# EAGLE design ESP SmartWatch (EAGLE 9.0.1)
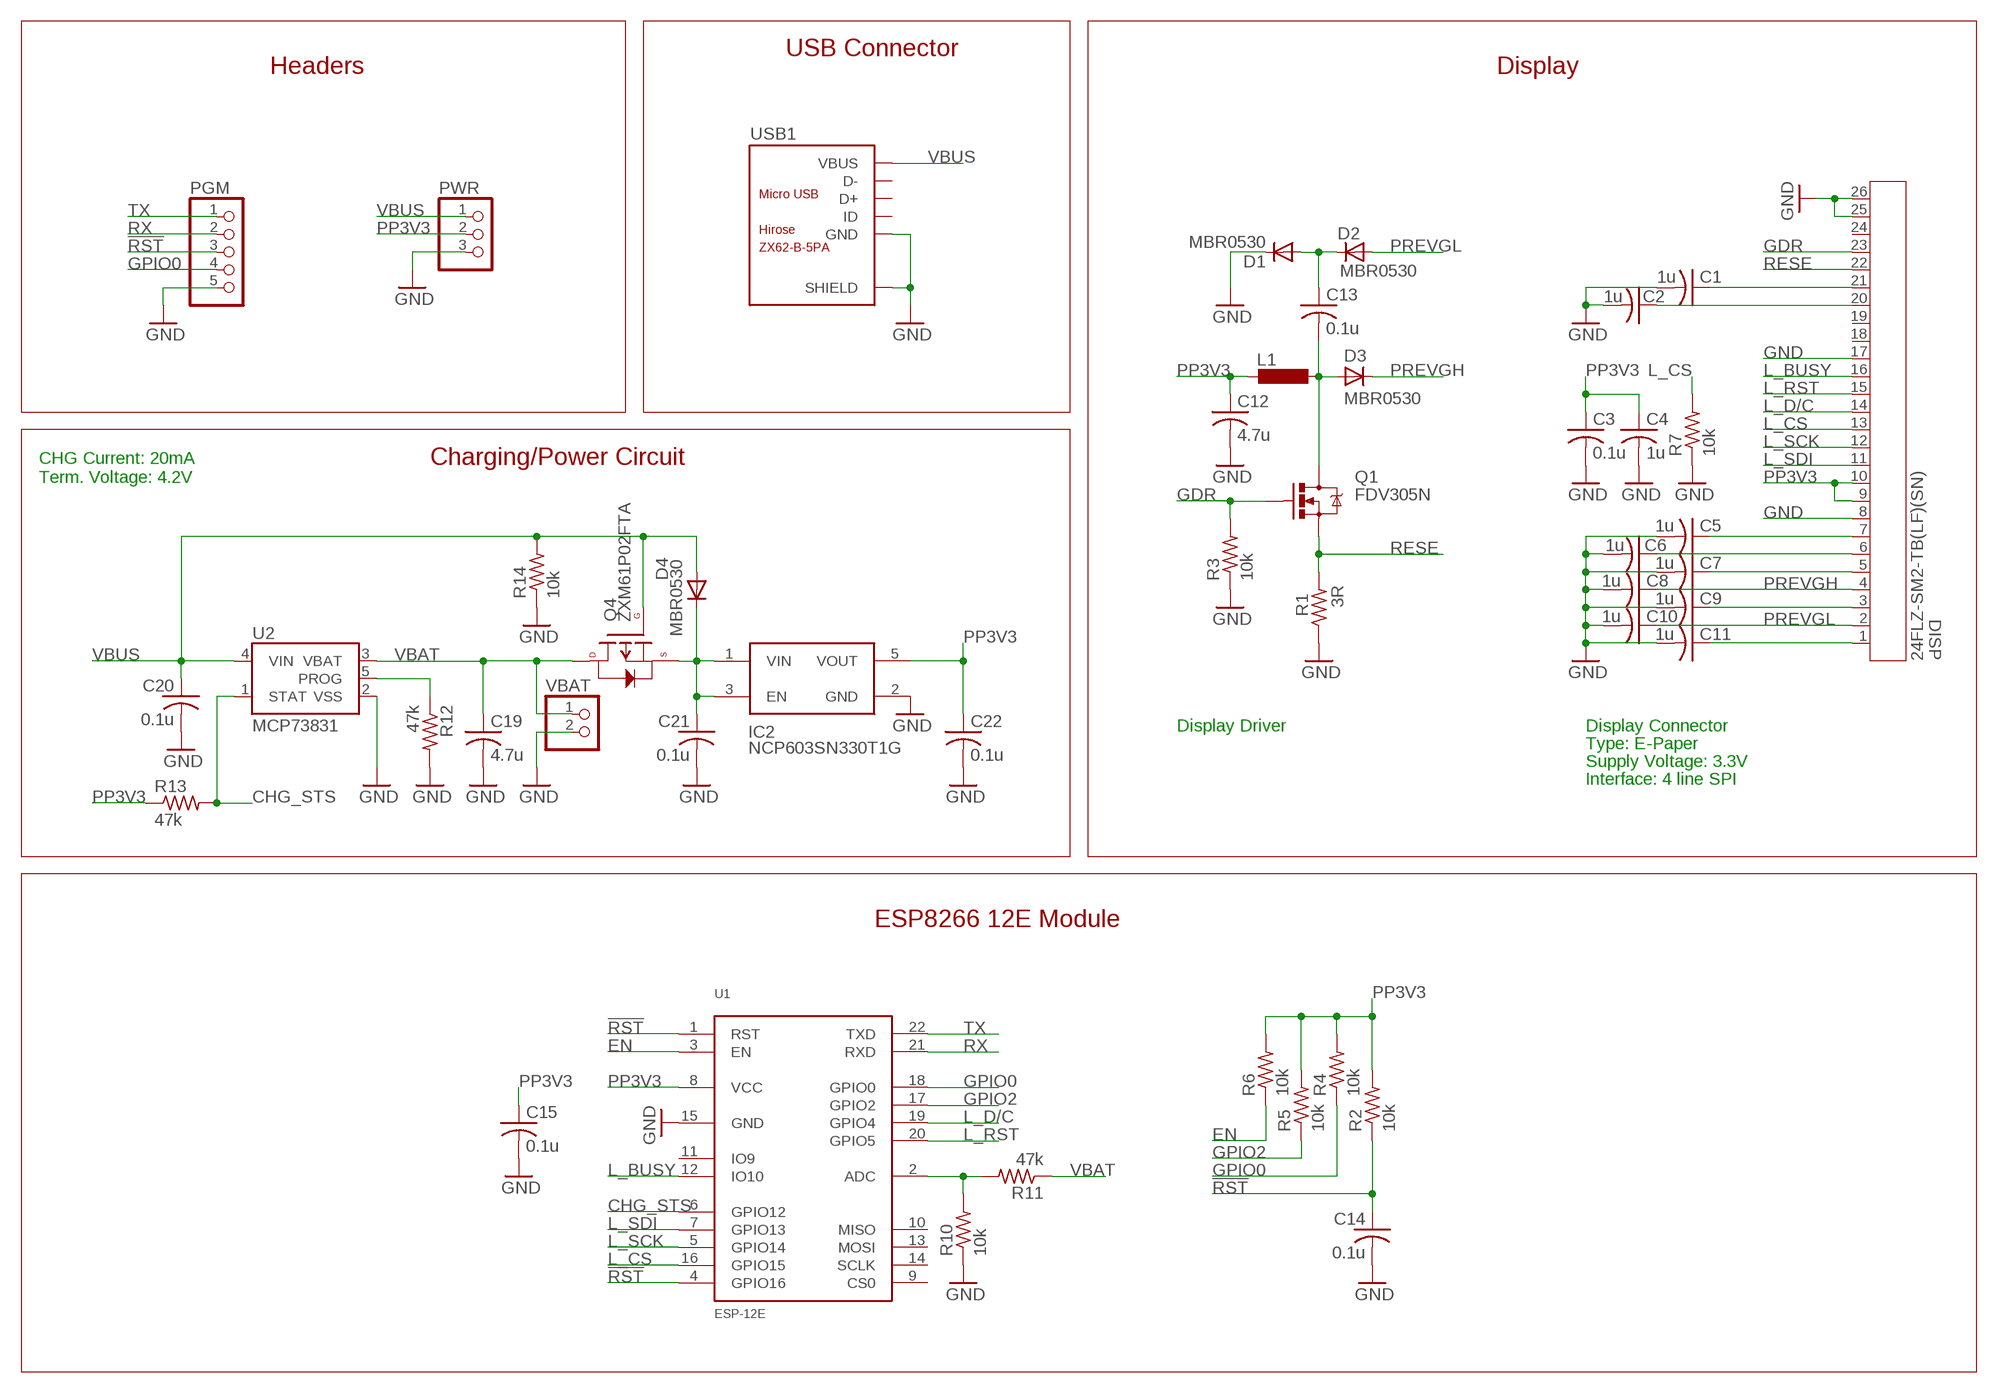
[diagram p0: schematic, sheet 1]

## Parts
C1  1u  C-USC0603  [C0603]
C2  1u  C-USC0603  [C0603]
C3  0.1u  C-USC0603  [C0603]
C4  1u  C-USC0603  [C0603]
C5  1u  C-USC0603  [C0603]
C6  1u  C-USC0603  [C0603]
C7  1u  C-USC0603  [C0603]
C8  1u  C-USC0603  [C0603]
C9  1u  C-USC0603  [C0603]
C10  1u  C-USC0603  [C0603]
C11  1u  C-USC0603  [C0603]
C12  4.7u  C-USC0603  [C0603]
C13  0.1u  C-USC0603  [C0603]
C14  0.1u  C-USC0603  [C0603]
C15  0.1u  C-USC0603  [C0603]
C19  4.7u  C-USC0603  [C0603]
C20  0.1u  C-USC0603  [C0603]
C21  0.1u  C-USC0603  [C0603]
C22  0.1u  C-USC0603  [C0603]
D1  MBR0530  MBR0520LT  [SOD123]
D2  MBR0530  MBR0520LT  [SOD123]
D3  MBR0530  MBR0520LT  [SOD123]
D4  MBR0530  MBR0520LT  [SOD123]
DISP  24FLZ-SM2-TB(LF)(SN)  [CON24_1X24_DB_JST]
IC2  NCP603SN330T1G  [SOT95P275X110-5N]
L1  ASPI-6045S-680M-T  [ASPI-6045S-680M-T]
PGM  PINHD-1X05_2.00  [1X05M]
PWR  PINHD-1X03_2.00  [1X03M]
Q1  FDV305N  MOSFET-NCHANNELAO3404A  [SOT23-3]
Q4  ZXM61P02FTA  P-CHANNEL-MOSFET  [SOT23-3]
R1  3R  R-US_R0603  [R0603]
R2  10k  R-US_R0603  [R0603]
R3  10k  R-US_R0603  [R0603]
R4  10k  R-US_R0603  [R0603]
R5  10k  R-US_R0603  [R0603]
R6  10k  R-US_R0603  [R0603]
R7  10k  R-US_R0603  [R0603]
R10  10k  R-US_R0603  [R0603]
R11  47k  R-US_R0603  [R0603]
R12  47k  R-US_R0603  [R0603]
R13  47k  R-US_R0603  [R0603]
R14  10k  R-US_R0603  [R0603]
U1  ESP-12E  ESP-12F  [ESP-12F]
U2  MCP73831  [SOT23-5]
USB1  ZX62-B-5PA  MICRO-USB-SMD(ZX62-B-5PA)  [MICRO-USB5+6P-SMD-0.65-AB]
VBAT  PINHD-1X02_2.00  [1X02M]

## Nets
!RST: C14.1 PGM.3 R2.1 U1.1(RST) U1.4(GPIO16)
CHG_STS: R13.2 U1.6(GPIO12) U2.1(STAT)
EN: R6.1 U1.3(EN)
GDR: DISP.23 Q1.1(G) R3.2
GND: C1.2 C2.2 C3.2 C4.2 C5.2 C6.2 C7.2 C8.2 C9.2 C10.2 C11.2 C12.2 C14.2 C15.2 C19.2 C20.2 C21.2 C22.2 D1.C DISP.8 DISP.17 DISP.25 DISP.26 IC2.2(GND) PGM.5 PWR.3 R1.1 R3.1 R7.1 R10.1 R12.2 R14.1 U1.15(GND) U2.2(VSS) USB1.5(GND) USB1.P1(SHIELD) USB1.P2(SHIELD) USB1.P3_1(SHIELD) USB1.P3_2(SHIELD) USB1.P3_3(SHIELD) USB1.P4_1(SHIELD) USB1.P4_2(SHIELD) USB1.P4_3(SHIELD) USB1.P5(SHIELD) USB1.P6(SHIELD) VBAT.2
GPIO0: PGM.4 R4.1 U1.18(GPIO0)
GPIO2: R5.1 U1.17(GPIO2)
L_BUSY: DISP.16 U1.12(IO10)
L_CS: DISP.13 R7.2 U1.16(GPIO15)
L_D/C: DISP.14 U1.19(GPIO4)
L_RST: DISP.15 U1.20(GPIO5)
L_SCK: DISP.12 U1.5(GPIO14)
L_SDI: DISP.11 U1.7(GPIO13)
N$1: C1.1 DISP.21
N$2: C2.1 DISP.20
N$3: C13.1 D1.A D2.C
N$5: C13.2 D3.A L1.2 Q1.3(D)
N$8: R10.2 R11.2 U1.2(ADC)
N$10: R12.1 U2.5(PROG)
N$12: C21.1 D4.C IC2.1(VIN) IC2.3(EN) Q4.2(S)
N$15: C5.1 DISP.7
N$16: C6.1 DISP.6
N$17: C7.1 DISP.5
N$19: C9.1 DISP.3
N$21: C11.1 DISP.1
PP3V3: C3.1 C4.1 C12.1 C15.1 C22.1 DISP.9 DISP.10 IC2.5(VOUT) L1.1 PWR.2 R2.2 R4.2 R5.2 R6.2 R13.1 U1.8(VCC)
PREVGH: C8.1 D3.C DISP.4
PREVGL: C10.1 D2.A DISP.2
RESE: DISP.22 Q1.2(S) R1.2
RX: PGM.2 U1.21(RXD)
TX: PGM.1 U1.22(TXD)
VBAT: C19.1 Q4.3(D) R11.1 U2.3(VBAT) VBAT.1
VBUS: C20.1 D4.A PWR.1 Q4.1(G) R14.2 U2.4(VIN) USB1.1(VBUS)
Unconnected: DISP.18 DISP.19 DISP.24 U1.9(CS0) U1.10(MISO) U1.11(IO9) U1.13(MOSI) U1.14(SCLK) USB1.2(D-) USB1.3(D+) USB1.4(ID)

## Notes on the sheet
- USB Connector
- Headers | Display
- Charging/Power Circuit
- CHG Current: 20mA
  Term. Voltage: 4.2V
- Display Driver | Display Connector
- Type: E-Paper
- Supply Voltage: 3.3V
- Interface: 4 line SPI
- ESP8266 12E Module

## Library data of the parts
C1-C15 C19-C22 = A1 VoLTE IoT Design:C-US: CAPACITOR, American symbol
D1-D4 = diode:MBR0520LT: SCHOTTKY BARRIER RECTIFIER Source: http://onsemi.com .. MBR0520LT1-D.pdf
DISP = 24FLZ-SM2-TB:24FLZ-SM2-TB(LF)(SN); MANUFACTURER_PART_NUMBER: 24FLZSM2TBLFSN; VENDOR: JST
IC2 = DusteeBoard:NCP603SN330T1G: Source: Datasheet <http://www.onsemi.com/pub/Collateral/NCP603-D.PDF>; ALLIED_NUMBER: 70467130; ALLIED_PRICE-STOCK: http://www.alliedelec.com/on-semiconductor-ncp603sn330t1g/70467130/; ARROW_PART_NUMBER: NCP603SN330T1G; ARROW_PRICE-STOCK: https://www.arrow.com/en/products/ncp603sn330t1g/on-semiconductor; HEIGHT: 1.1mm; MANUFACTURER_NAME: ON Semiconductor; MANUFACTURER_PART_NUMBER: NCP603SN330T1G; RS_PART_NUMBER: 8051845P; RS_PRICE-STOCK: http://uk.rs-online.com/web/p/products/8051845P
L1 = Customs:ASPI-6045S-680M-T
PGM = pinhead-2:PINHD-1X05: PIN HEADER
PWR = pinhead-2:PINHD-1X03: PIN HEADER
Q1 = LORA Gateway wGSM:MOSFET-NCHANNEL: Common NMOSFET Parts MFG P/N Store ID Prod ID FDD8780 TRANS-09984 SI7820DN TRANS-11055 FDS6630A IC-08089 2N7002PW TRANS-11151 FQP30N06L COM-10213 TRANS-10060 BSS123LT1G TRANS-08345 BSS138 TRANS-00830 BS170 2N7000; PROD_ID: TRAN-12988
Q4 = A1 VoLTE IoT Design:P-CHANNEL-MOSFET: P-Channel MOSFET Mode Field Effect Transistor
R1-R7 R10-R14 = adafruit:R-US_: RESISTOR, American symbol
U1 = Seeed-OPL-2017-01-Sensor-camilo:ESP-12F: 317060163
U2 = DusteeBoard:MCP73831: Miniature single cell, fully integrated Li-Ion, Li-polymer charge management controller http://ww1.microchip.com/downloads/en/DeviceDoc/20001984g.pdf IC-09995; PROD_ID: IC-09995
USB1 = A1 VoLTE IoT Design:MICRO-USB-SMD(ZX62-B-5PA): 320010005; MPN: ZX62-B-5PA
VBAT = pinhead-2:PINHD-1X02: PIN HEADER

## Board
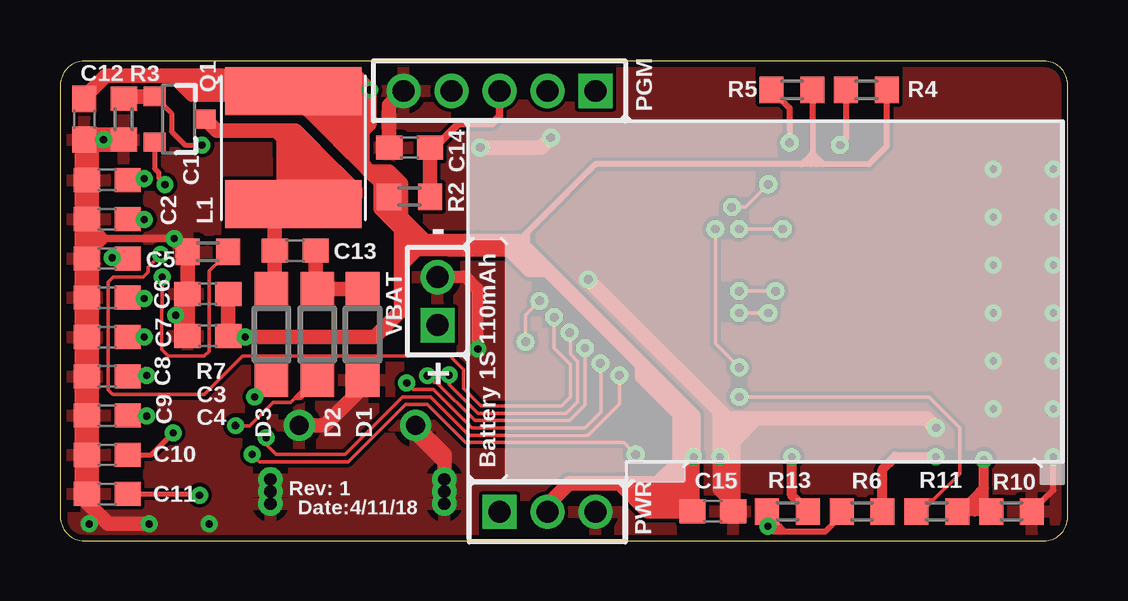
[diagram p1: board, top side]
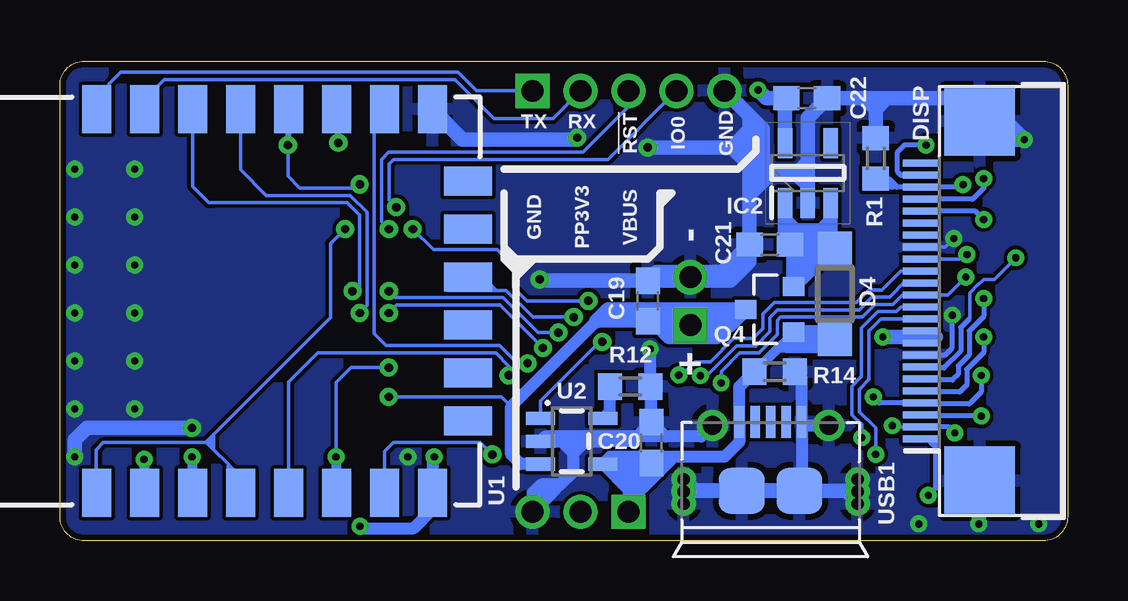
[diagram p2: board, bottom side, seen from below]

Size 42 x 20 mm. Coordinates in mm from the lower left corner, seen from the top.
Outline: 0,19 0,1 arc90 1,0 41,0 arc90 42,1 42,19 arc90 41,20 1,20 arc90 0,19
Copper layers (1*16): Top 0.035mm / dielectric 1.5mm / Bottom 0.035mm
Design rules "SeeedStudio_2layer_DRU_no_angle_20140221 *": minimum track width 6mil, minimum drill 0.3mm, track to track 6mil, track to pad 6mil, pad to pad 6mil, via to via 6mil, smd to smd 0mil, copper to edge 10mil, drill to drill 6mil, minimum pad ring 10mil, minimum via ring 8mil, stop-mask expansion 4mil, vias tented up to drill 0.75mm, thermal gap 10mil

### Footprints (pad centres in the part's own frame; a part is rotated, then mirrored left to right if it is on the bottom)
C0603 = smd 1.1 x 1: 1 -0.85,0; 2 0.85,0
SOD123 = smd 1.4 x 1.4: A 1.9,0; C -1.9,0
CON24_1X24_DB_JST = smd 0.3 x 1.524: 1 5.75,-2.698; 2 5.25,-2.698; 3 4.75,-2.698; 4 4.25,-2.698; 5 3.75,-2.698; 6 3.25,-2.698; 7 2.75,-2.698; 8 2.25,-2.698; 9 1.75,-2.698; 10 1.25,-2.698; 11 0.75,-2.698; 12 0.25,-2.698; 13 -0.25,-2.698; 14 -0.75,-2.698; 15 -1.25,-2.698; 16 -1.75,-2.698; 17 -2.25,-2.698; 18 -2.75,-2.698; 19 -3.25,-2.698; 20 -3.75,-2.698; 21 -4.25,-2.698; 22 -4.75,-2.698; 23 -5.25,-2.698; 24 -5.75,-2.698 | smd 2.845 x 2.946: 25 -7.493,-0.26; 26 7.493,-0.26
SOT95P275X110-5N = smd 1.25 x 0.6: 1 -1.25,0.95; 2 -1.25,0; 3 -1.25,-0.95; 4 1.25,-0.95; 5 1.25,0.95
ASPI-6045S-680M-T = smd 2 x 5.7: 1 -2.35,0; 2 2.35,0
1X05M = drill 0.914 square: 1 -4,0 | drill 0.914: 2 -2,0; 3 0,0; 4 2,0; 5 4,0
1X03M = drill 0.914 square: 1 -2,0 | drill 0.914: 2 0,0; 3 2,0
SOT23-3 = smd 0.8 x 0.9: 1 -0.95,-1; 2 0.95,-1; 3 0,1.1
SOT23-3' = smd 0.8 x 0.9: 1 -0.95,-1; 2 0.95,-1; 3 0,1
R0603 = smd 1 x 1.1: 1 -0.85,0; 2 0.85,0
ESP-12F = smd 2 x 1.2: 1 -8,3.48; 2 -8,1.48; 3 -8,-0.52; 4 -8,-2.52; 5 -8,-4.52; 6 -8,-6.52; 7 -8,-8.52; 8 -8,-10.52; 15 8,-10.52; 16 8,-8.52; 17 8,-6.52; 18 8,-4.52; 19 8,-2.52; 20 8,-0.52; 21 8,1.48; 22 8,3.48 | smd 1.2 x 2: 9 -5,-12; 10 -3,-12; 11 -1,-12; 12 1,-12; 13 3,-12; 14 5,-12
SOT23-5 = smd 0.55 x 1.2: 1 -0.95,-1.3; 2 0,-1.3; 3 0.95,-1.3; 4 0.95,1.3; 5 -0.95,1.3
MICRO-USB5+6P-SMD-0.65-AB = smd 0.4 x 1.35: 1 -1.3,2.875; 2 -0.65,2.875; 3 0,2.875; 4 0.65,2.875; 5 1.3,2.875 | smd 1.9 x 1.9: P1 -1.2,0; P2 1.2,0 | drill 0.508 pad 1.016: P3_1 -3.625,-0.533; P3_2 -3.625,-0.025; P3_3 -3.625,0.483; P4_1 3.625,-0.533; P4_2 3.625,-0.025; P4_3 3.625,0.483 | drill 0.8: P5 -2.425,2.73; P6 2.425,2.73
1X02M = drill 0.914 square: 1 -1,0 | drill 0.914: 2 1,0

### Placement (x,y rotation side)
C1  1.96,15.05 180 top
C2  1.96,13.41 180 top
C3  6.15,10.3 180 top
C4  6.15,8.55 180 top
C5  1.96,11.77 180 top
C6  1.96,10.14 180 top
C7  1.96,8.5 180 top
C8  1.96,6.86 180 top
C9  1.96,5.23 180 top
C10  1.96,3.59 180 top
C11  1.96,1.95 180 top
C12  1,17.58 270 top
C13  9.79,12.1 180 top
C14  14.56,16.4 180 top
C15  27.2,1.23 0 top
C19  17.5,10 90 bottom
C20  17.35,4.09 90 bottom
C21  12.41,12.35 180 bottom
C22  10.87,18.45 0 bottom
D1  12.6,8.6 90 top
D2  10.71,8.6 270 top
D3  8.8,8.6 90 top
D4  9.7,10.3 270 bottom
DISP  3.4,10 270 bottom
IC2  10.83,15.34 90 bottom
L1  9.71,16.39 270 top
PGM  18.3,18.76 180 top
PWR  20.3,1.2 0 top
Q1  4.93,17.58 270 top
Q4  ZXM61P02FTA  [SOT23-3']  12.42,9.65 90 bottom
R1  8,15.95 270 bottom
R2  14.56,14.35 180 top
R3  2.64,17.58 90 top
R4  33.6,18.8 0 top
R5  30.5,18.8 0 top
R6  33.42,1.23 180 top
R7  6.15,12.05 0 top
R10  39.65,1.23 180 top
R11  36.54,1.23 0 top
R12  18.23,6.43 0 bottom
R13  30.31,1.23 0 top
R14  12.21,7.05 180 bottom
U1  37,10 90 bottom
U2  20.67,4.15 270 bottom
USB1  12.38,2.08 0 bottom
VBAT  15.73,9.99 90 top

### Tracks (layer width: path | path; a pad name or v marks a point on that pad's centre or on a via)
!RST  (via drill 0.35)
  Top 0.152: v28.29,13 v30.12,13
  Top 0.305: C14.1 15.6,16.4 16.6,17.4 18,17.4 18.3,17.7 PGM.3
  Top 0.61: R2.1 C14.1
  Bottom 0.152: PGM.3 18.3,18.1 20.2,16.2 28.3,16.2 28.59,15.91 28.59,13.3 v28.29,13 | v30.12,13 30.72,12.39 30.72,9.31 35.6,4.43 | U1.1 40.5,2.03 40.5,3.8 40.2,4.1 35.93,4.1 | 35.6,4.43 35.7,4.33 | 35.8,4.23 35.93,4.1 | 35.93,4.1 35.9,4.1 35.8,4 | 34.64,2.16 35,2.53 35,3.2 | 35.8,4 35.7,3.9 | 35.7,3.9 35.6,3.8 | 35.6,3.8 35,3.2 | 35,3.2 34.9,3.1 | 34.9,3.1 34.64,2.84 | 34.64,2.84 34.64,2.16 | 34.9,2.6 34.9,2.43 U1.4 | 34.9,2.6 34.9,3.1 | U1.4 34.64,2.16 | 35.8,4 35.8,4.1 | 35.8,4.1 35.8,4.23 | 35.8,4.23 35.7,4.33 | 35.7,3.9 35.7,4.33 | 35.6,3.8 35.6,4.1 | 35.6,4.1 35.6,4.43 | 35.6,4.1 35.8,4.1 | U1.4 34.48,2.18 34.9,2.6 | 34.64,2.84 34.48,2.68 34.48,2.4 U1.4
CHG_STS  (via drill 0.3, 0.35)
  Top 0.152: v19.39,8.3 19.39,9.42 v19.98,10 | v27.3,13 27.3,8.23 v28.3,7.23
  Top 0.406: R13.2 30.5,1.89 v30.5,3.5
  Bottom 0.152: U2.1 21.97,5.83 19.51,8.3 v19.39,8.3 | v19.98,10 22.54,10 23.09,10.56 23.09,11.46 23.78,12.14 24.8,12.14 26.44,12.14 v27.3,13 | v28.3,7.23 29.88,7.23 30.5,6.6 v30.5,3.5
  Bottom 0.406: v30.5,3.5 30.5,2.03 U1.6
EN  (via drill 0.3)
  Top 0.406: R6.1 34.27,2.98 34.8,3.5 v36.5,3.5
  Bottom 0.406: v36.5,3.5 36.5,2.03 U1.3
GDR  (via drill 0.3)
  Top 0.2: Q1.1 4.63,17.83 4.63,17.07 5.2,16.5 v5.9,16.5
  Top 0.61: Q1.1 2.74,18.53 R3.2
  Bottom 0.2: v5.9,16.5 6.8,16.5 7.12,16.18 7.12,15.42 6.95,15.25 DISP.23
GND  (via drill 0.3, 0.35)
  Top 0.152: USB1.P3_1 USB1.P3_2 | USB1.P4_2 USB1.P4_1 USB1.P4_3
  Top 0.2: 5.2,12.05 R7.1
  Top 0.254: R10.1 41.39,2.12 v41.39,3.5
  Top 0.305: 1.11,12.8 1.3,12.6 1.9,12.6 | 1.9,12.6 4.55,12.6 | 4.55,12.6 5.1,12.05 | 4.55,12.6 v4.75,12.6 R7.1 | 1.9,12.6 1.55,12.95 | 1.55,12.95 1.11,13.4 C2.2 | 1.9,12.6 1.11,11.8 C5.2 1.55,12.22 1.55,12.95
  Top 0.508: v17.4,8 17.4,10.5 16.91,10.99 VBAT.2
  Top 0.61: 5.3,9.6 C4.2 5.3,8.91 v4.81,9.41 | 5.3,9.6 C3.2 | C3.2 R7.1 | v4.81,9.41 5.1,9.41 5.3,9.6 | v4.81,9.41 5.3,9.9 C3.2 | 5.1,12.05 5.2,12.05 | C11.2 1.11,1.59 2,0.7 v3.7,0.7 | 14.49,4.81 USB1.P5 | USB1.P5 16.01,3.61 16.01,3.3 | 16.01,3.3 USB1.P3_3 | 12.91,6.7 D1.C 12.6,6.4 11.01,4.81 USB1.P6 | USB1.P5 14.8,4.5 16.01,3.3 | C14.2 13.71,18.17 PGM.5 | v27.5,3.5 28.05,2.95 | 28.05,2.95 28.05,1.6 | 28.05,1.6 C15.2 | v20.45,16.81 20.04,16.4 v17.5,16.4 | v22,10.9 27.5,5.4 | 27.5,5.4 27.5,5.1 | 27.5,5.1 27.5,4.1 | 27.5,4.1 v27.5,3.5 | 27.5,5.1 27.8,5.1 | 28.4,5.1 29,5.1 | 29,5.1 36.11,5.1 v36.5,4.71 | 27.5,4.1 28.05,4.65 | 28.05,4.65 28.4,5 28.4,5.1 | 27.5,5.4 27.8,5.1 | 27.8,5.1 28.4,5.1 | 28.05,2.95 28.05,4.15 | 28.05,4.15 28.05,4.65 | 28.05,4.15 29,5.1 | v27.5,3.5 27.5,2.15 28.05,1.6
  Top 1.016: C11.2 C10.2 C9.2 C8.2 C7.2 C6.2 C5.2 1.11,12.8 C2.2 C1.2 1.11,16.62 | 1.11,16.62 C12.2 | R3.1 v1.8,16.73 1.21,16.73 1.11,16.62
  Bottom 0.152: DISP.17 5.1,12.25 v4.75,12.6
  Bottom 0.2: DISP.8 5.11,7.75 4.81,8.04 v4.81,9.4 v4.81,9.41
  Bottom 0.508: USB1.5 11.08,6.77 R14.1 | C20.2 17.35,6.4 R12.2 17.38,7.98 v17.4,8 | 21.1,4.15 U2.2 21.77,4.34 17.95,4.34 | 21.1,4.15 20.6,4.15 | 20.6,4.15 20.1,4.15 | 20.1,4.15 19.35,4.15 19.34,4.16 18.13,4.16 17.95,4.34 | 17.95,4.34 C20.2 | USB1.5 10.93,4.81 USB1.P6 | USB1.5 11.08,2.18 USB1.P2 | 13.3,2.08 USB1.P1 13.6,2.1 14.6,2.1 | 9.8,2.08 9.29,2.08 USB1.P4_1 8.75,2 USB1.P4_3 | USB1.P3_2 USB1.P3_1 16.01,2.1 | 16.01,2.1 USB1.P3_3 | 14.9,2.1 16.01,2.1 | USB1.P5 15.27,4.34 16.76,4.34 | 16.76,4.34 17.95,4.34 | 16.76,4.34 C20.2 | 21.5,2 PWR.3 22.3,2 | 21.5,2 21.15,2.35 | 21.15,2.35 20.6,2.9 20.6,3.65 | 20.6,3.65 20.6,4.15 | 20.6,3.65 21.1,4.15 | 20.6,3.65 20.1,4.15 | 21.15,2.35 21.95,2.35 22.3,2 | 21.5,2 22.3,2
  Bottom 0.61: 10.83,15.7 10.83,17.64 C22.2 8.45,18.45 | 10.83,15.7 10.83,15.3 | 10.83,15.3 10.83,14.83 | 10.83,14.83 IC2.2 | C21.2 13.26,14.44 | 12.4,15.3 11.3,15.3 | 11.3,15.3 10.83,15.3 | 13.26,14.44 12.7,15 | 12.7,15 12.4,15.3 | 11.3,15.3 10.9,15.7 10.83,15.7 | 11.3,15.3 10.83,14.83 | 8.45,18.45 8.1,18.45 | 8.1,18.45 7.55,18.45 | 7.55,18.45 4.62,18.45 3.84,17.66 | 3.84,17.66 DISP.25 | 2.8,16.73 v1.8,16.73 2.67,17.6 2.9,17.6 2.9,16.83 2.8,16.73 | 2.8,16.73 3.93,16.73 4,16.8 3.84,16.96 3.84,17.66 | R1.1 8,18 | 8,18 8,18.35 8.1,18.45 | 8,18 8.45,18.45 | 8,18 7.55,18.45 | v3.7,0.7 3.7,2.47 DISP.26 | 12.1,2.08 USB1.P2 9.8,2.08 8.84,2.08 8.75,2 | 12.1,2.08 13.3,2.08 13.32,2.1 | USB1.P1 15.98,2.08 16.01,2.1 | 13.32,2.1 12.12,2.1 12.1,2.08 | 13.32,2.1 14.6,2.1 14.9,2.1 15.54,2.1 USB1.P3_3 | 14.4,10.99 13.91,10.99 | C21.2 13.26,11.64 13.91,10.99 | C21.2 14.4,11.21 | 14.4,11.21 14.4,10.99 | 14.4,10.99 14.54,10.85 16.8,10.85 | 16.8,10.85 C19.2 | VBAT.2 15.87,10.85 14.05,10.85 13.91,10.99 | 14.4,11.21 14.62,11.21 | 14.62,11.21 15.51,11.21 | 15.51,11.21 15.7,11.21 | 15.7,11.21 16.3,11.21 | 16.3,11.21 17.14,11.21 C19.2 | VBAT.2 15.73,11.18 15.7,11.21 | VBAT.2 16.08,10.99 16.3,11.21 | VBAT.2 15.51,11.21 | 14.4,10.99 14.62,11.21 | VBAT.2 14.4,10.99 | VBAT.2 16.66,10.99 16.8,10.85 | PGM.5 13.22,17.68 | 13.22,17.68 12.7,17.16 12.7,16.3 | 12.7,15.6 12.4,15.3 | 12.7,16.3 12.7,15.6 | 12.7,15.6 12.7,15 | U1.15 25.21,16.74 20.52,16.74 v20.45,16.81 | v17.5,16.4 14,16.4 | 14,16.4 12.8,16.4 12.7,16.3 | 13.26,14.44 13.26,15.2 | 13.26,15.2 13.26,16.3 | 13.26,16.3 13.26,17.14 | 13.26,17.14 13.26,17.64 13.22,17.68 | 13.26,16.3 12.7,16.3 | 13.26,15.2 13.1,15.2 | 13.1,15.2 12.7,15.6 | 14,16.4 13.1,15.5 13.1,15.2
  Bottom 0.61: 14,16.4 13.26,17.14 | C19.2 21.95,10.85 v22,10.9 | v36.5,4.71 40.89,4.71 41.39,4.21 v41.39,3.5
  other vias: 41.39,5.5 41.39,7.5 41.39,9.5 41.39,11.5 41.39,13.5 41.39,15.5 1.2,0.7 6.2,0.7 38.89,15.5 38.89,13.5 38.89,11.5 38.89,9.5 38.89,7.5 38.89,5.5
  pour Top: -4,-3.5 42.5,-3.5 44,-2 44,21.5 42.5,23 -1,23 -4.5,20.5 -4.5,-3
  pour Bottom: -3,-4 42,-4 44,-2 44,21.5 42.5,23 -2.5,23 -5,20.5 -5,-2
GPIO0  (via drill 0.35)
  Top 0.152: v27.99,13.91 28.55,13.91 v29.51,14.87
  Top 0.254: R4.1 32.75,16.75 v32.5,16.5
  Bottom 0.152: PGM.4 19.16,15.9 28.09,15.9 28.29,15.7 28.29,14.21 v27.99,13.91 | v29.51,14.87 29.67,14.7 32,14.7 32.5,15.2 v32.5,16.5
  Bottom 0.254: v32.5,16.5 32.48,16.52 U1.18
GPIO2  (via drill 0.35)
  Top 0.254: R5.1 30.4,18.05 v30.4,16.6
  Bottom 0.254: v30.4,16.6 30.4,17.93 U1.17
L_BUSY  (via drill 0.3, 0.35)
  Top 0.152: v4.19,11.94 3.66,11.41 3.66,11.2 3.46,11 2.2,11 2,10.8 2,6.29 2.16,6.13 2.17,6.13 2.2,6.1 6,6.1 7.6,7.7 16.24,7.7 16.8,7.14 16.8,6.35 17.53,5.62 20.88,5.62 21.26,6 21.26,7.36 20.58,8.04 v20.58,9.33
  Bottom 0.152: DISP.16 4.39,11.75 v4.19,11.94 | v20.58,9.33 22.29,9.33 23.41,10.44 23.8,10.44 | 24.43,10.44 24.7,10.7 | 24.7,10.7 24.9,10.9 | 24.9,10.9 U1.12 24.9,10.91 24.9,10.7 | 23.8,10.44 23.9,10.44 | 23.9,10.44 24.3,10.84 24.3,11.1 24.35,11.05 | 24.35,11.05 24.5,10.9 24.9,10.9 | 23.8,10.44 24.35,10.99 24.35,11.05 | 23.9,10.44 24.2,10.44 24.8,10.44 25.84,10.44 25.9,10.5 25.7,10.7 24.9,10.7 | 24.9,10.7 24.7,10.7
L_CS  (via drill 0.3, 0.35)
  Top 0.152: R7.2 6.2,11.25 6.2,7.9 6,7.7 4.5,7.7 4.22,7.98 4.22,9.65 4.24,9.66 v4.24,11 | v14.44,6.58 14.44,6.56 14.7,6.3 15.56,6.3 17.15,4.71 21.88,4.71 22.53,5.37 22.53,7.38 v22.51,7.4
  Bottom 0.152: v4.24,11 5,10.25 DISP.13 6.88,10.25 7.27,9.86 8.03,9.86 8.56,9.33 11.96,9.33 12.1,9.2 12.1,8.6 12.87,7.83 13.67,7.83 14.44,7.06 v14.44,6.58 | v22.51,7.4 22.94,7.4 23.68,8.14 28.4,8.14 28.9,8.64 28.9,17.58 U1.16
L_D/C  (via drill 0.3, 0.35)
  Top 0.152: v15.3,6.88 15.57,6.61 15.69,6.61 17.28,5.01 21.21,5.01 21.87,5.67 v21.87,8.04 | v28.29,9.5 v29.51,9.5
  Bottom 0.152: DISP.14 6.84,10.75 7.09,10.49 7.09,10.47 7.4,10.16 8.15,10.16 8.68,9.63 12.09,9.63 12.4,9.32 12.4,8.73 13,8.13 13.8,8.13 15.05,6.88 v15.3,6.88 | v21.87,8.04 23.66,9.83 27.96,9.83 v28.29,9.5 | v29.51,9.5 29.2,9.8 29.2,13.7 29.9,14.4 33.4,14.4 34.48,15.48 U1.19
L_RST  (via drill 0.3, 0.35)
  Top 0.152: v16.21,6.91 16.21,6.52 17.41,5.32 21.09,5.32 21.56,5.8 21.56,7.49 21.26,7.79 21.26,8.65 v21.23,8.68 | v28.29,10.41 v29.81,10.41
  Bottom 0.152: DISP.15 6.95,11.25 7.73,10.47 8.28,10.47 8.81,9.94 12.22,9.94 12.71,9.45 12.71,8.85 13.12,8.44 13.92,8.44 14.9,7.47 15.54,7.47 16.1,6.91 v16.21,6.91 | v21.23,8.68 22.08,8.68 23.54,10.14 28.02,10.14 v28.29,10.41 | v29.81,10.41 29.69,10.41 29.51,10.59 29.51,13.58 30.03,14.09 35.6,14.09 35.7,14.09 35.8,14.09 36.48,14.78 U1.20
L_SCK  (via drill 0.3, 0.35)
  Top 0.152: v8.58,4.3 8.58,4.02 9,3.6 11.87,3.6 14.27,6 15.43,6 17.03,4.41 22.01,4.41 23.3,5.7 v23.3,6.9
  Bottom 0.152: DISP.12 6.95,9.75 7.15,9.55 7.9,9.55 8.59,8.87 8.59,6.84 8.99,6.44 8.99,5.26 8.58,4.85 v8.58,4.3 | v23.3,6.9 23.3,7.3 23.83,7.83 31.27,7.83 32.48,6.62 U1.5
L_SDI  (via drill 0.3, 0.35)
  Top 0.152: v8,3.6 8.3,3.3 12,3.3 14.39,5.69 15.31,5.69 16.9,4.1 23.48,4.1 v23.98,3.6
  Bottom 0.152: DISP.11 7.78,9.25 8.28,8.74 8.28,6.72 8.68,6.32 8.68,5.38 8,4.7 v8,3.6 | U1.7 28.48,3.72 28.1,4.1 24.48,4.1 v23.98,3.6
N$1  (via drill 0.3)
  Top 0.2: C1.1 3.45,15.05 v3.5,15.1
  Top 0.61: v3.5,15.1 2.85,15.1 C1.1
  Bottom 0.2: v3.5,15.1 3.5,14.7 3.95,14.25 DISP.21
N$2  (via drill 0.3)
  Top 0.61: v3.5,13.4 C2.1
  Bottom 0.2: v3.5,13.4 3.85,13.75 DISP.20
N$3
  Top 0.61: C13.1 10.64,10.57 D2.C D1.A
N$5
  Top 0.61: D3.A 8.94,10.64 C13.2 8.94,13.94 9.04,14.04 L1.2 | Q1.3 6.51,17.1 9,17.1 | 9.71,15.7 9.71,16.39 9.3,16.8 | 9.71,15.7 9.71,14.4 | 9.71,14.4 L1.2 | 9.3,16.1 9.71,15.7 | 9.3,16.1 9.3,14.8 9.71,14.4 | 9,17.1 9.8,17.1 10.2,16.7 | 10.2,16.7 10.2,16.2 | 10.2,16.2 10.2,15.7 | 10.2,15.7 10.2,14.53 L1.2 | 10.2,15.7 9.71,15.7 | 9.3,16.1 9.3,16.8 | 9.3,16.8 9,17.1 | 10.2,16.7 11.1,15.8 | 11.1,15.8 11.8,15.1 | 11.8,15.1 12.3,14.6 12.3,14.4 11.1,14.4 | 11.1,14.4 11,14.4 10.7,14.1 10.7,15.7 10.2,16.2 | 11.1,15.8 11.1,15.1 | 11.1,15.1 11.1,14.4 | 11.1,15.1 11.8,15.1
N$8  (via drill 0.3)
  Top 0.406: 38.1,1.23 R10.2 38.5,1.52 38.5,2.2 | 38.1,1.23 R11.2 37.52,1.23 38.1,1.8 | 38.5,2.2 v38.5,3.4 | 38.1,1.8 38.5,2.2 | 38.1,1.23 38.1,1.8
  Bottom 0.406: v38.5,3.4 38.5,2.03 U1.2
N$10
  Bottom 0.508: U2.5 19.08,5.39 R12.1
N$12
  Bottom 0.61: Q4.2 11.42,11.6 | 11.42,11.6 11.42,12.21 C21.1 | D4.C 9.85,12.35 C21.1 | D4.C 10,12.2 | 10,12.2 10.4,12.2 | 10.4,12.2 10.82,12.2 11.42,11.6 | Q4.2 11.42,11.18 10.4,12.2 | Q4.2 10,12.02 10,12.2 | IC2.1 11.78,13.38 | 11.78,13.38 11.78,12.9 | 11.78,12.9 11.78,12.57 C21.1 | IC2.3 9.88,13.5 9.88,13.32 | 9.88,13.32 9.88,12.9 | 9.88,12.9 9.88,12.38 D4.C | 9.88,12.9 10.3,12.9 | 10.3,12.9 11.3,12.9 | 11.3,12.9 11.78,12.9 | 11.3,12.9 11.78,13.38 | 10.3,12.9 9.88,13.32
N$15  (via drill 0.3)
  Top 0.152: v2.16,11.8 2.19,11.77 C5.1
  Bottom 0.152: 4.11,9.25 4.08,9.27 4.08,10.34 3.74,10.68 3.72,10.68 3.5,10.9 3.06,10.9 v2.16,11.8
  Bottom 0.2: 4.11,9.25 4.46,8.9 4.46,7.9 5.15,7.2 6.05,7.2 DISP.7
N$16  (via drill 0.3)
  Top 0.2: C6.1 3.46,10.14 v3.5,10.1
  Top 0.61: v3.5,10.1 2.84,10.1 C6.1
  Bottom 0.2: v3.5,10.1 3.5,9.36 4.11,8.75 4.11,7.75 4.56,7.3 4.56,6.94 4.8,6.7 6.05,6.7 DISP.6
N$17  (via drill 0.3)
  Top 0.61: v3.5,8.5 C7.1
  Bottom 0.2: v3.5,8.5 3.5,7.86 4.21,7.15 4.21,6.49 4.5,6.2 6.05,6.2 DISP.5
N$19  (via drill 0.3)
  Top 0.2: C9.1 3.58,5.23 v3.6,5.2
  Top 0.61: v3.6,5.2 2.83,5.2 C9.1
  Bottom 0.2: v3.6,5.2 6.05,5.2 DISP.3
N$21  (via drill 0.3)
  Top 0.2: C11.1 5.75,1.95 v5.8,1.9
  Bottom 0.2: v5.8,1.9 5.5,2.2 5.5,3.9 | 5.85,4.25 5.55,4.25 5.5,4.2 5.5,3.9 | DISP.1 5.9,4.25 5.85,4.25 | 5.5,3.9 5.85,4.25
PP3V3  (via drill 0.3)
  Top 0.254: R6.2 32.58,1.08 31.88,0.38 30.2,0.38 | 29.73,0.38 v29.5,0.61 29.7,0.61 | 30.2,0.38 29.73,0.38 | R13.1 29.46,1.12 29.97,0.61 | 29.97,0.61 30.2,0.38 | 29.7,0.61 29.97,0.61 | 29.73,0.38 29.73,0.58 29.7,0.61 | R5.2 31.35,16.15 | R4.2 34.45,16.45 33.7,15.7 31.8,15.7 | 31.35,16.15 31.5,16 | 31.5,16 31.8,15.7 | 31.8,15.7 31.5,15.7 | 31.5,15.7 31.3,15.7 | 31.3,15.7 30.9,15.7 | 30.9,15.7 22.3,15.7 19.45,12.85 | 19.45,12.85 19.1,12.5 | 19.45,12.85 19.45,12.15 | 31.35,16.15 31.25,16.05 | 31.25,16.05 30.9,15.7 | 31.25,16.05 31.3,16 31.3,15.7 | 31.5,16 31.5,15.7
  Top 0.508: C15.1 26.35,2.2 26.35,2.6 | 26.35,3.45 v26.4,3.5 | v29.5,0.61 29.46,0.65 R13.1 | v26.4,3.5 26.2,3.3 25.8,3.3 26,3.5 v26.4,3.5 | 26.14,4.2 25.8,4.2
  Top 0.61: C3.1 C4.1 7.65,8.55 v7.7,8.5 13.1,8.5 14.2,9.6 14.2,11.5 | C12.1 1,18.5 1.9,19.4 4.7,19.4 | L1.1 9.65,18.8 8.7,18.8 8.1,19.4 7.7,19.4 | 4.7,19.4 6.2,19.4 | 6.2,19.4 7.7,19.4 | 7.7,19.4 7.7,18.7 7.3,18.3 7,18.6 | 6.2,19.4 6.7,18.9 | 6.7,18.9 7,18.6 | 4.7,19.4 5.2,18.9 | 5.2,18.9 6.7,18.9 | 5.2,18.9 5.5,18.6 7,18.6 | v12.9,18.8 12.84,18.74 12.6,18.74 | 12.6,18.74 11.26,18.74 | 10.6,18.74 L1.1 | 13.71,14.59 R2.2 14.2,13.86 | 13.71,14.59 13.35,14.95 | 13.35,14.95 12.9,15.4 | 12.9,15.4 12.6,15.7 | 12.6,15.7 12.6,16.3 | 12.6,16.3 12.6,16.7 | 12.6,16.7 12.6,17.1 | 12.6,17.1 12.6,17.4 | 12.6,17.4 12.6,18.74 | v12.9,18.8 12.26,19.44 11.9,19.44 12.6,18.74 | v12.9,18.8 12.9,17.4 12.6,17.1 | 12.6,17.4 11.26,18.74 | 11.26,18.74 10.6,18.74 | 12.6,16.7 11.85,17.45 | 11.85,17.45 11.5,17.8 | 11.5,17.8 11.1,18.2 | 11.1,18.2 10.6,18.7 10.6,18.74 | 11.1,17.2 9.71,18.59 L1.1 | 12.6,15.7 11.75,16.55 | 11.75,16.55 11.45,16.85 | 11.45,16.85 11.1,17.2 | 11.1,17.2 11.1,18.2 | 11.45,16.85 11.45,17.75 11.5,17.8 | 11.75,16.55 11.75,17.35 11.85,17.45 | 12.6,16.3 12.35,16.55 11.75,16.55 | 14.2,14.1 13.71,14.59 | 14.2,11.5 14.2,12 | 14.2,12 14.2,12.5 | 14.2,12.5 14.2,13 | 14.2,13 14.2,13.5 | 14.2,13.86 14.2,14.1 | PWR.2 20.3,1.5 21.2,2.4 23.3,2.4 | 24.48,1.23 25.2,1.23 | 25.2,1.23 25.6,1.23 | 25.6,1.23 C15.1 26.35,2.38 | 23.3,2.4 23.75,1.95 | 23.75,1.95 24.48,1.23 | 25.6,1.23 26.35,1.98 26.35,2.2 | 25.2,1.23 26.14,2.16 | 26.14,2.16 26.35,2.38 | 26.35,2.38 26.35,2.6 26.35,3.1 | v26.4,3.5 26.4,5.2 26.14,5.46 | 15.2,12.5 15,12.5 | 15,12.5 14.7,12.5 | 14.7,12.5 14.2,12.5 | 25.8,5.8 24.25,7.35 | 24.25,7.35 20.3,11.3 | 20.3,11.3 19.45,12.15 | 19.45,12.15 19.1,12.5 17.4,12.5 | 14.7,12.5 14.2,13 | 14.7,12.5 14.36,12.16
  Top 0.61: 15.2,12.5 14.2,11.5 | 15.2,12.5 14.2,13.5 | 14.2,13.5 14.2,13.86 | 14.2,13 13.35,13.85 13.35,14.95 | 14.2,14.1 14.2,14.9 13.7,15.4 12.9,15.4 | 24.48,1.23 25.2,1.95 | 25.2,1.95 26.35,3.1 | 26.35,3.1 26.35,3.45 | 23.3,2.4 24.9,2.4 | 24.9,2.4 25.4,2.4 | 25.4,2.4 25.9,2.4 26.14,2.16 | 23.75,1.95 25.2,1.95 | 15.2,12.5 17.4,12.5 | 26.14,2.16 26.14,4.2 26.14,5.46 | 26.14,5.46 25.8,5.8 | 25.4,2.4 25.8,2.8 25.8,3.3 | 25.8,3.3 25.8,4.2 25.8,5.3 | 25.8,5.3 25.8,5.8 | 24.9,2.4 25.8,3.3 | 25.8,5.3 24.25,6.85 24.25,7.35 | 15,12.5 15.34,12.16 | 15.34,12.16 16.21,12.16 16.22,12.15 17.5,12.15 | 17.5,12.15 18.7,12.15 | 18.7,12.15 19.45,12.15 | 15.34,12.16 14.36,12.16 | 14.36,12.16 14.2,12 | 17.5,12.15 17.5,12.4 17.4,12.5 | 18.7,12.15 19.55,11.3 20.3,11.3
  Bottom 0.2: DISP.9 6.1,8.5 DISP.10
  Bottom 0.508: v26.4,3.5 26.48,3.42 U1.8 26.48,1.32 27.29,0.51 29.4,0.51 v29.5,0.61
  Bottom 0.61: v7.7,8.5 6.1,8.5 5.5,8.5 | IC2.5 11.78,18.39 C22.1 12.55,18.45 v12.9,18.8
PREVGH  (via drill 0.3)
  Top 0.2: C8.1 3.56,6.86 v3.6,6.9 | v8.1,6 D3.C
  Top 0.61: v3.6,6.9 2.84,6.9 C8.1
  Bottom 0.2: v3.6,6.9 3.6,6.2 4.1,5.7 6.05,5.7 DISP.4 7.85,5.75 v8.1,6
PREVGL  (via drill 0.3)
  Top 0.152: v7.3,4.8 7.9,4.8 8.87,5.77 9.6,5.77 9.76,5.94 | 9.76,5.94 9.79,5.97 10.4,6.58 10.62,6.58 | 9.76,5.94 9.97,5.94 10.12,6.08
  Top 0.2: C10.1 3.79,3.59 v4.7,4.5 | 10.01,5.97 10.12,6.08 10.62,6.58 10.71,6.67 D2.A
  Bottom 0.152: DISP.2 7.25,4.75 v7.3,4.8
  Bottom 0.2: v4.7,4.5 4.95,4.75 DISP.2
RESE  (via drill 0.3)
  Top 0.2: Q1.2 3.93,15.53 4.11,15.35 4.11,15.11 v4.36,14.85
  Bottom 0.2: v4.36,14.85 4.46,14.75 DISP.22 7.1,14.75 | 7.1,14.75 7.3,14.75 | 7.3,14.75 7.65,14.75 R1.2 | R1.2 7.65,15.1 7.3,14.75 | 7.1,14.75 7.45,15.1 R1.2
RX
  Bottom 0.152: PGM.2 21.46,17.6 23.9,17.6 25.53,19.23 37.67,19.23 38.48,18.42 U1.21
TX
  Bottom 0.152: PGM.1 24.63,18.76 25.41,19.54 39.46,19.54 40.48,18.52 U1.22
VBAT  (via drill 0.35)
  Top 0.152: v28.3,6 36.2,6 37.5,4.7 37.5,2.8 36.4,1.7 | 35.73,1.27 36.16,1.7 | 36.16,1.7 36.4,1.7 | 36.4,1.7 36.25,1.55 | 36.25,1.55 35.97,1.27 35.73,1.27 | 36.25,1.55 36.16,1.64 36.16,1.7 | R11.1 35.73,1.27
  Top 0.254: R11.1 35.69,0.99
  Bottom 0.152: 23.2,5.6 23.6,6 v28.3,6
  Bottom 0.508: U2.3 22.8,3.2 23.2,3.6 23.2,5.6 19.65,9.15 18.9,9.15 | 18.9,9.15 18.6,9.15 C19.1 15.89,9.15 VBAT.1 | 18.9,9.15 18.7,9.35 18.7,9.65
  Bottom 0.61: C19.1 17.34,8.99 17.1,8.99 | 17.1,8.99 VBAT.1 | Q4.3 13.74,9.65 | 14.14,9.24 15,9.24 | 15,9.24 15.7,9.24 | 15.7,9.24 17.41,9.24 C19.1 | VBAT.1 15.73,9.22 15.7,9.24 | 14.08,8.99 Q4.3 | Q4.3 14.6,9.65 | 14.6,9.65 15,9.24 | 14.6,9.65 17,9.65 | 17,9.65 C19.1 | 17,9.65 18.7,9.65 19.15,9.65 19.65,9.15 | 14.08,8.99 VBAT.1 | 14.08,8.99 14.1,8.97 14.14,8.97 14.62,8.5 16.61,8.5 17.1,8.99
VBUS
  Bottom 0.406: R14.2 12.72,7.4 12.69,7.4 12.04,8.05 | Q4.1 11.67,8.45 11.67,8.42 12.04,8.05 | 11.4,8.4 11.75,8.05 | 11.75,8.05 12.04,8.05 | 11.75,8.05 10.15,8.05 9.8,8.4
  Bottom 0.508: U2.4 19,3.2 | 19,3.2 18.4,3.2 | 18.4,3.2 17.6,3.2 | PWR.1 18.3,1.6 | 18.3,1.6 18.3,1.9 | 18.3,2.13 18.3,2.5 | 18.3,2.5 18.3,3.1 18.4,3.2 | 18.3,2.5 18,2.8 | 18,2.8 17.6,3.2 | 17.6,3.2 17.39,3.2 C20.1 17.09,3.5 | 18.3,2.5 19,3.2 | 16.4,3.5 14.3,3.5 13.68,4.12 USB1.1 13.68,6.43 R14.2 | 16.4,3.5 17.09,3.5 | 16.4,3.5 17.4,2.5 | 17.4,2.5 17.7,2.5 | 17.7,2.5 18.3,2.5 | 17.7,2.5 18.3,1.9 | 17.4,2.5 18.3,1.6 | 17.09,3.5 17.9,3.5 | 17.9,3.5 19.07,3.5 U2.4 | 17.9,3.5 18,3.4 18,2.8 | U2.4 18.3,2.13 | 18.3,2.13 18.3,1.9
  Bottom 0.61: Q4.1 11.4,8.68 | 11.4,8.68 11.4,8.4 9.8,8.4 D4.A 9.98,8.68 11.4,8.68

### Text on the board
tPlace: - | + | Battery 1S 110mAh | Rev: 1 | Date:4/11/18
bPlace: RX | TX | GND | IO0 | !RST | VBUS | PP3V3 | GND | - | +